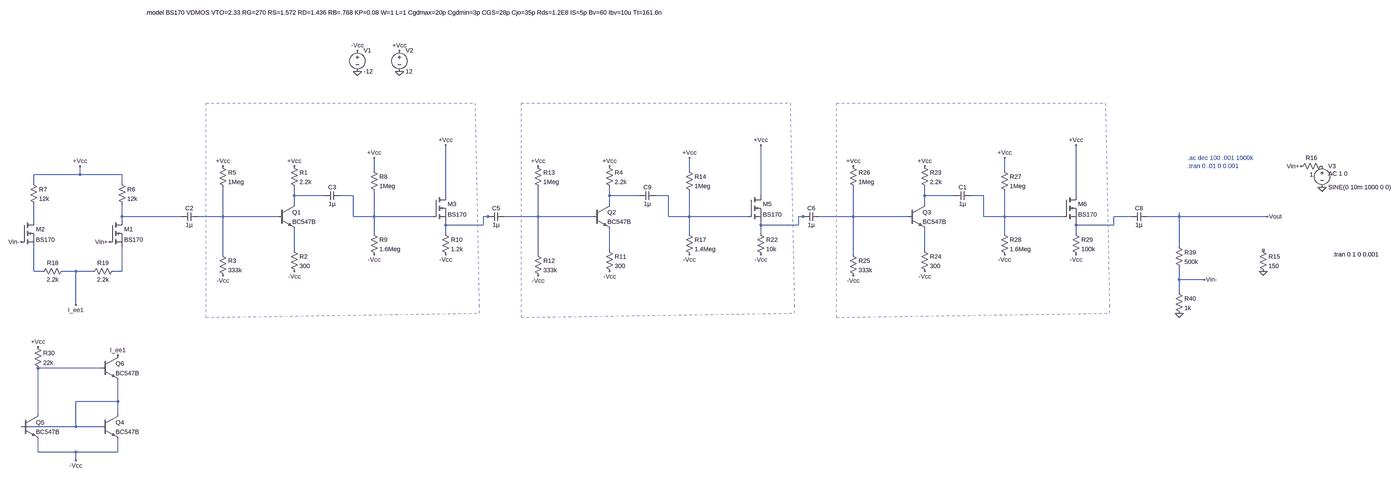
[diagram p0: schematic full_circuit.asc, whole sheet]
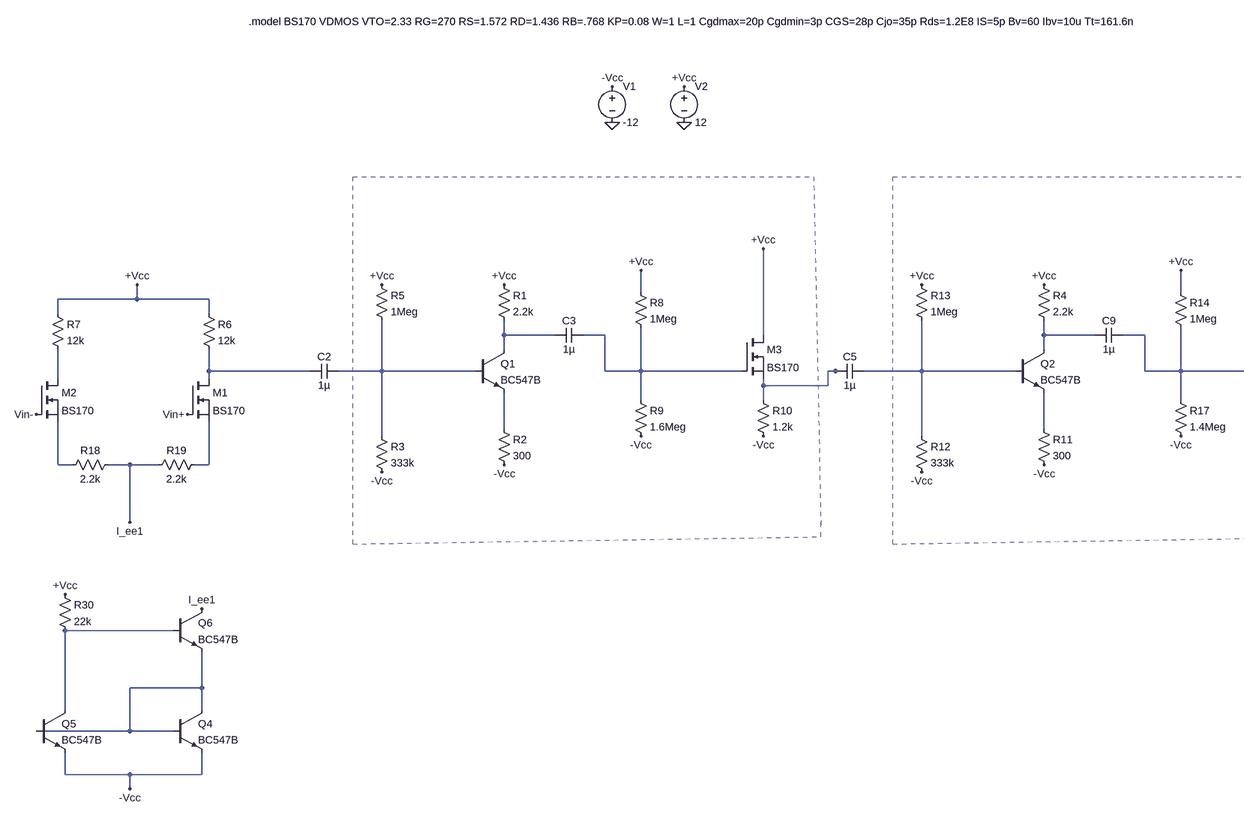
[diagram p1: schematic full_circuit.asc, part, row 1 of 1, column 1 of 2]
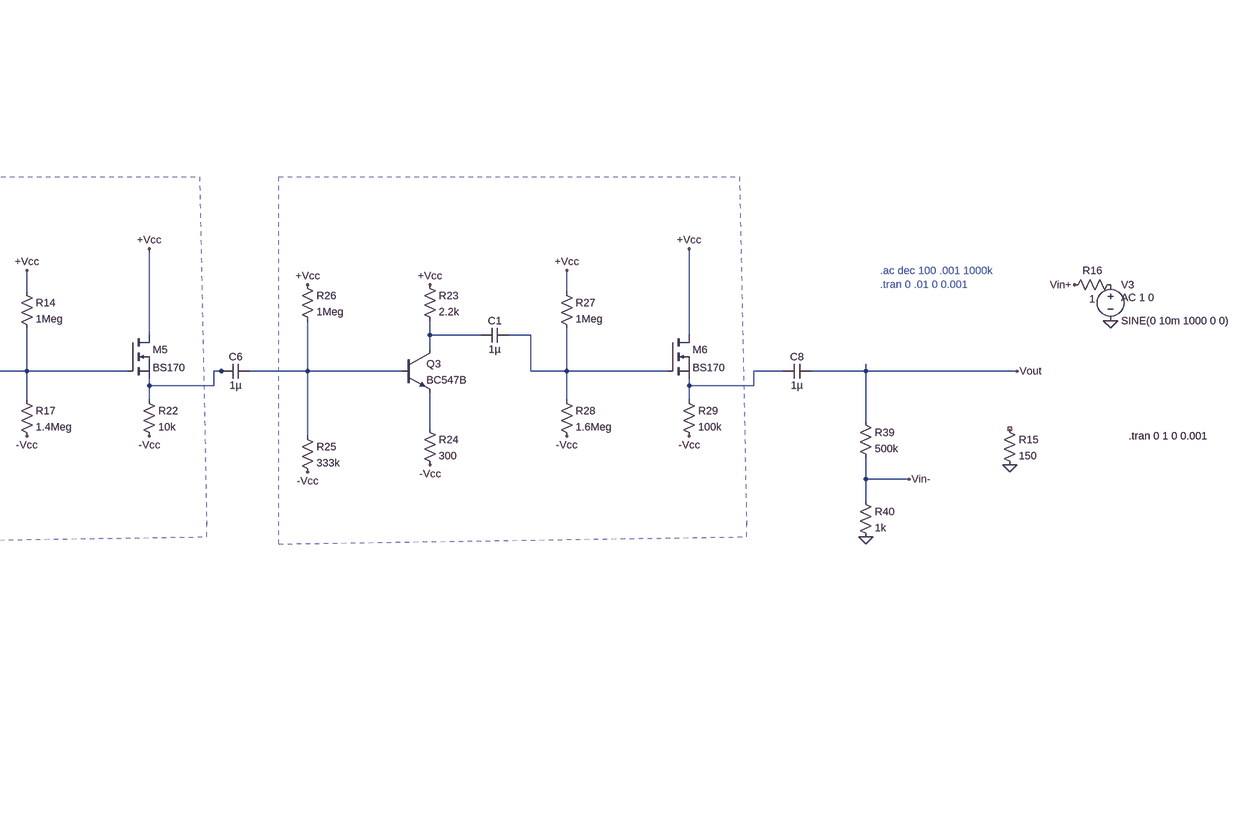
[diagram p2: schematic full_circuit.asc, part, row 1 of 1, column 2 of 2]
full_circuit.asc, the LTspice schematic file:
Version 4
SHEET 1 4124 732
WIRE -752 -1360 -752 -1408
WIRE 448 -1360 448 -1408
WIRE 1648 -1360 1648 -1408
WIRE -1872 -1344 -1872 -1376
WIRE -1872 -1344 -2048 -1344
WIRE -1712 -1344 -1872 -1344
WIRE -2048 -1312 -2048 -1344
WIRE -1712 -1312 -1712 -1344
WIRE -1056 -1264 -1056 -1296
WIRE -944 -1264 -1056 -1264
WIRE -832 -1264 -880 -1264
WIRE -480 -1264 -480 -1456
WIRE 144 -1264 144 -1296
WIRE 256 -1264 144 -1264
WIRE 368 -1264 320 -1264
WIRE 720 -1264 720 -1456
WIRE 1344 -1264 1344 -1296
WIRE 1456 -1264 1344 -1264
WIRE 1568 -1264 1520 -1264
WIRE 1920 -1264 1920 -1456
WIRE -1056 -1232 -1056 -1264
WIRE 144 -1232 144 -1264
WIRE 1344 -1232 1344 -1264
WIRE -1712 -1184 -1712 -1232
WIRE -1488 -1184 -1712 -1184
WIRE -1328 -1184 -1328 -1296
WIRE -1328 -1184 -1424 -1184
WIRE -1120 -1184 -1328 -1184
WIRE -832 -1184 -832 -1264
WIRE -752 -1184 -752 -1280
WIRE -752 -1184 -832 -1184
WIRE -528 -1184 -752 -1184
WIRE -320 -1184 -336 -1184
WIRE -304 -1184 -320 -1184
WIRE -128 -1184 -128 -1296
WIRE -128 -1184 -256 -1184
WIRE 80 -1184 -128 -1184
WIRE 368 -1184 368 -1264
WIRE 448 -1184 448 -1280
WIRE 448 -1184 368 -1184
WIRE 672 -1184 448 -1184
WIRE 880 -1184 864 -1184
WIRE 896 -1184 880 -1184
WIRE 1072 -1184 1072 -1296
WIRE 1072 -1184 944 -1184
WIRE 1280 -1184 1072 -1184
WIRE 1568 -1184 1568 -1264
WIRE 1648 -1184 1648 -1280
WIRE 1648 -1184 1568 -1184
WIRE 1872 -1184 1648 -1184
WIRE 2128 -1184 2064 -1184
WIRE 2336 -1184 2336 -1200
WIRE 2336 -1184 2192 -1184
WIRE 2672 -1184 2336 -1184
WIRE -2048 -1168 -2048 -1232
WIRE -1712 -1168 -1712 -1184
WIRE -480 -1152 -480 -1168
WIRE -336 -1152 -336 -1184
WIRE -336 -1152 -480 -1152
WIRE 720 -1152 720 -1168
WIRE 864 -1152 864 -1184
WIRE 864 -1152 720 -1152
WIRE 1920 -1152 1920 -1168
WIRE 2064 -1152 2064 -1184
WIRE 2064 -1152 1920 -1152
WIRE -752 -1120 -752 -1184
WIRE -480 -1120 -480 -1152
WIRE 448 -1120 448 -1184
WIRE 720 -1120 720 -1152
WIRE 1648 -1120 1648 -1184
WIRE 1920 -1120 1920 -1152
WIRE 2336 -1072 2336 -1184
WIRE -1056 -1056 -1056 -1136
WIRE 144 -1056 144 -1136
WIRE 1344 -1056 1344 -1136
WIRE -1328 -1040 -1328 -1184
WIRE -128 -1040 -128 -1184
WIRE 1072 -1040 1072 -1184
WIRE -2048 -976 -2048 -1072
WIRE -2016 -976 -2048 -976
WIRE -1888 -976 -1936 -976
WIRE -1824 -976 -1888 -976
WIRE -1712 -976 -1712 -1072
WIRE -1712 -976 -1744 -976
WIRE 2336 -944 2336 -992
WIRE 2432 -944 2336 -944
WIRE 2336 -896 2336 -944
WIRE -1888 -848 -1888 -976
WIRE -1792 -608 -2032 -608
WIRE -1728 -480 -1728 -560
WIRE -1728 -480 -1888 -480
WIRE -2032 -432 -2032 -608
WIRE -1728 -432 -1728 -480
WIRE -1888 -384 -1888 -480
WIRE -1888 -384 -2096 -384
WIRE -1792 -384 -1888 -384
WIRE -2032 -288 -2032 -336
WIRE -1888 -288 -2032 -288
WIRE -1728 -288 -1728 -336
WIRE -1728 -288 -1888 -288
WIRE -1888 -256 -1888 -288
FLAG -816 -1760 0
FLAG -656 -1760 0
FLAG -816 -1840 -Vcc
FLAG -656 -1840 +Vcc
FLAG -1872 -1376 +Vcc
FLAG -1760 -1088 Vin+
FLAG -2096 -1088 Vin-
FLAG -1328 -1376 +Vcc
FLAG -1056 -1376 +Vcc
FLAG -1328 -960 -Vcc
FLAG -1056 -976 -Vcc
FLAG -752 -1408 +Vcc
FLAG -480 -1456 +Vcc
FLAG -752 -1040 -Vcc
FLAG -480 -1040 -Vcc
FLAG 2336 -816 0
FLAG 2432 -944 Vin-
FLAG 2880 -1296 0
FLAG 2800 -1376 Vin+
FLAG 2672 -1184 Vout
FLAG -128 -1376 +Vcc
FLAG 144 -1376 +Vcc
FLAG -128 -960 -Vcc
FLAG 144 -976 -Vcc
FLAG 448 -1408 +Vcc
FLAG 720 -1456 +Vcc
FLAG 448 -1040 -Vcc
FLAG 720 -1040 -Vcc
FLAG 1072 -1376 +Vcc
FLAG 1344 -1376 +Vcc
FLAG 1072 -960 -Vcc
FLAG 1344 -976 -Vcc
FLAG 1648 -1408 +Vcc
FLAG 1920 -1456 +Vcc
FLAG 1648 -1040 -Vcc
FLAG 1920 -1040 -Vcc
FLAG -1888 -256 -Vcc
FLAG -2032 -688 +Vcc
FLAG -1728 -656 I_ee1
FLAG -1888 -848 I_ee1
FLAG 2656 -976 0
SYMBOL voltage -816 -1856 R0
WINDOW 123 0 0 Left 0
WINDOW 39 0 0 Left 0
SYMATTR InstName V1
SYMATTR Value -12
SYMBOL voltage -656 -1856 R0
WINDOW 123 0 0 Left 0
WINDOW 39 0 0 Left 0
SYMATTR InstName V2
SYMATTR Value 12
SYMBOL nmos -2096 -1168 R0
SYMATTR InstName M2
SYMATTR Value BS170
SYMBOL res -1728 -1328 R0
SYMATTR InstName R6
SYMATTR Value 12k
SYMBOL res -2064 -1328 R0
SYMATTR InstName R7
SYMATTR Value 12k
SYMBOL nmos -1760 -1168 R0
SYMATTR InstName M1
SYMATTR Value BS170
SYMBOL res -1920 -992 R90
WINDOW 0 0 56 VBottom 2
WINDOW 3 32 56 VTop 2
SYMATTR InstName R18
SYMATTR Value 2.2k
SYMBOL res -1728 -992 R90
WINDOW 0 0 56 VBottom 2
WINDOW 3 32 56 VTop 2
SYMATTR InstName R19
SYMATTR Value 2.2k
SYMBOL cap -1424 -1200 R90
WINDOW 0 0 32 VBottom 2
WINDOW 3 32 32 VTop 2
SYMATTR InstName C2
SYMATTR Value 1µ
SYMBOL npn -1120 -1232 R0
SYMATTR InstName Q1
SYMATTR Value BC547B
SYMBOL res -1072 -1392 R0
SYMATTR InstName R1
SYMATTR Value 2.2k
SYMBOL res -1072 -1072 R0
SYMATTR InstName R2
SYMATTR Value 300
SYMBOL res -1344 -1056 R0
SYMATTR InstName R3
SYMATTR Value 333k
SYMBOL res -1344 -1392 R0
SYMATTR InstName R5
SYMATTR Value 1Meg
SYMBOL nmos -528 -1264 R0
SYMATTR InstName M3
SYMATTR Value BS170
SYMBOL res -768 -1376 R0
SYMATTR InstName R8
SYMATTR Value 1Meg
SYMBOL res -768 -1136 R0
SYMATTR InstName R9
SYMATTR Value 1.6Meg
SYMBOL res -496 -1136 R0
SYMATTR InstName R10
SYMATTR Value 1.2k
SYMBOL cap -256 -1200 R90
WINDOW 0 0 32 VBottom 2
WINDOW 3 32 32 VTop 2
SYMATTR InstName C5
SYMATTR Value 1µ
SYMBOL res 2320 -1088 R0
SYMATTR InstName R39
SYMATTR Value 500k
SYMBOL res 2320 -912 R0
SYMATTR InstName R40
SYMATTR Value 1k
SYMBOL voltage 2880 -1392 R0
WINDOW 123 24 44 Left 2
WINDOW 39 0 0 Left 0
SYMATTR Value2 AC 1 0
SYMATTR InstName V3
SYMATTR Value SINE(0 10m 1000 0 0)
SYMBOL res 2896 -1392 R90
WINDOW 0 0 56 VBottom 2
WINDOW 3 32 56 VTop 2
SYMATTR InstName R16
SYMATTR Value 1
SYMBOL npn 80 -1232 R0
SYMATTR InstName Q2
SYMATTR Value BC547B
SYMBOL res 128 -1392 R0
SYMATTR InstName R4
SYMATTR Value 2.2k
SYMBOL res 128 -1072 R0
SYMATTR InstName R11
SYMATTR Value 300
SYMBOL res -144 -1056 R0
SYMATTR InstName R12
SYMATTR Value 333k
SYMBOL res -144 -1392 R0
SYMATTR InstName R13
SYMATTR Value 1Meg
SYMBOL nmos 672 -1264 R0
SYMATTR InstName M5
SYMATTR Value BS170
SYMBOL res 432 -1376 R0
SYMATTR InstName R14
SYMATTR Value 1Meg
SYMBOL res 432 -1136 R0
SYMATTR InstName R17
SYMATTR Value 1.4Meg
SYMBOL res 704 -1136 R0
SYMATTR InstName R22
SYMATTR Value 10k
SYMBOL cap 944 -1200 R90
WINDOW 0 0 32 VBottom 2
WINDOW 3 32 32 VTop 2
SYMATTR InstName C6
SYMATTR Value 1µ
SYMBOL npn 1280 -1232 R0
SYMATTR InstName Q3
SYMATTR Value BC547B
SYMBOL res 1328 -1392 R0
SYMATTR InstName R23
SYMATTR Value 2.2k
SYMBOL res 1328 -1072 R0
SYMATTR InstName R24
SYMATTR Value 300
SYMBOL res 1056 -1056 R0
SYMATTR InstName R25
SYMATTR Value 333k
SYMBOL res 1056 -1392 R0
SYMATTR InstName R26
SYMATTR Value 1Meg
SYMBOL nmos 1872 -1264 R0
SYMATTR InstName M6
SYMATTR Value BS170
SYMBOL res 1632 -1376 R0
SYMATTR InstName R27
SYMATTR Value 1Meg
SYMBOL res 1632 -1136 R0
SYMATTR InstName R28
SYMATTR Value 1.6Meg
SYMBOL res 1904 -1136 R0
SYMATTR InstName R29
SYMATTR Value 100k
SYMBOL cap 2192 -1200 R90
WINDOW 0 0 32 VBottom 2
WINDOW 3 32 32 VTop 2
SYMATTR InstName C8
SYMATTR Value 1µ
SYMBOL npn -1792 -432 R0
SYMATTR InstName Q4
SYMATTR Value BC547B
SYMBOL npn -2096 -432 R0
SYMATTR InstName Q5
SYMATTR Value BC547B
SYMBOL npn -1792 -656 R0
SYMATTR InstName Q6
SYMATTR Value BC547B
SYMBOL res -2048 -704 R0
SYMATTR InstName R30
SYMATTR Value 22k
SYMBOL res 2640 -1072 R0
SYMATTR InstName R15
SYMATTR Value 150
SYMBOL cap -880 -1280 R90
WINDOW 0 0 32 VBottom 2
WINDOW 3 32 32 VTop 2
SYMATTR InstName C3
SYMATTR Value 1µ
SYMBOL cap 320 -1280 R90
WINDOW 0 0 32 VBottom 2
WINDOW 3 32 32 VTop 2
SYMATTR InstName C9
SYMATTR Value 1µ
SYMBOL cap 1520 -1280 R90
WINDOW 0 0 32 VBottom 2
WINDOW 3 32 32 VTop 2
SYMATTR InstName C1
SYMATTR Value 1µ
TEXT -1624 -2048 Left 2 !.model BS170 VDMOS VTO=2.33 RG=270 RS=1.572 RD=1.436 RB=.768 KP=0.08 W=1 L=1 Cgdmax=20p Cgdmin=3p CGS=28p Cjo=35p Rds=1.2E8 IS=5p Bv=60 Ibv=10u Tt=161.6n
TEXT 2368 -1408 Left 2 ;.ac dec 100 .001 1000k\n.tran 0 .01 0 0.001
TEXT 2920 -1040 Left 2 !.tran 0 1 0 0.001
LINE Normal -1392 -800 -1392 -1616 2
LINE Normal -368 -1616 -352 -832 2
LINE Normal -1392 -1616 -368 -1616 2
LINE Normal -352 -816 -352 -848 2
LINE Normal -1392 -800 -352 -816 2
LINE Normal -192 -800 -192 -1616 2
LINE Normal 832 -1616 848 -832 2
LINE Normal -192 -1616 832 -1616 2
LINE Normal 848 -816 848 -848 2
LINE Normal -192 -800 848 -816 2
LINE Normal 1008 -800 1008 -1616 2
LINE Normal 2032 -1616 2048 -832 2
LINE Normal 1008 -1616 2032 -1616 2
LINE Normal 2048 -816 2048 -848 2
LINE Normal 1008 -800 2048 -816 2

The netlist it stands for:
* full_circuit.asc
V1 -Vcc 0 -12
V2 +Vcc 0 12
M2 N014 Vin- N018 N018 BS170
R6 +Vcc N007 12k
R7 +Vcc N014 12k
M1 N007 Vin+ N019 N019 BS170
R18 I_ee1 N018 2.2k
R19 N019 I_ee1 2.2k
C2 N008 N007 1µ
Q1 N001 N008 N015 0 BC547B
R1 +Vcc N001 2.2k
R2 N015 -Vcc 300
R3 N008 -Vcc 333k
R5 +Vcc N008 1Meg
M3 +Vcc N002 N009 N009 BS170
R8 +Vcc N002 1Meg
R9 N002 -Vcc 1.6Meg
R10 N009 -Vcc 1.2k
C5 N010 N009 1µ
R39 Vout Vin- 500k
R40 Vin- 0 1k
V3 P001 0 SINE(0 10m 1000 0 0) AC 1 0
R16 P001 Vin+ 1
Q2 N003 N010 N016 0 BC547B
R4 +Vcc N003 2.2k
R11 N016 -Vcc 300
R12 N010 -Vcc 333k
R13 +Vcc N010 1Meg
M5 +Vcc N004 N011 N011 BS170
R14 +Vcc N004 1Meg
R17 N004 -Vcc 1.4Meg
R22 N011 -Vcc 10k
C6 N012 N011 1µ
Q3 N005 N012 N017 0 BC547B
R23 +Vcc N005 2.2k
R24 N017 -Vcc 300
R25 N012 -Vcc 333k
R26 +Vcc N012 1Meg
M6 +Vcc N006 N013 N013 BS170
R27 +Vcc N006 1Meg
R28 N006 -Vcc 1.6Meg
R29 N013 -Vcc 100k
C8 Vout N013 1µ
Q4 N021 N021 -Vcc 0 BC547B
Q5 N020 N021 -Vcc 0 BC547B
Q6 I_ee1 N020 N021 0 BC547B
R30 +Vcc N020 22k
R15 NC_01 0 150
C3 N002 N001 1µ
C9 N004 N003 1µ
C1 N006 N005 1µ
.model NPN NPN
.model PNP PNP
.lib standard.bjt
.model NMOS NMOS
.model PMOS PMOS
.lib standard.mos
.model BS170 VDMOS VTO=2.33 RG=270 RS=1.572 RD=1.436 RB=.768 KP=0.08 W=1 L=1 Cgdmax=20p Cgdmin=3p CGS=28p Cjo=35p Rds=1.2E8 IS=5p Bv=60 Ibv=10u Tt=161.6n
* .ac dec 100 .001 1000k
* .tran 0 .01 0 0.001
.tran 0 1 0 0.001
.backanno
.end